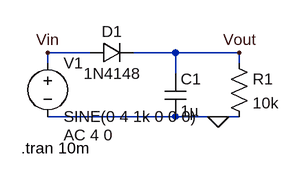
[diagram p0: schematic 9c.asc]
9c.asc, the LTspice schematic file:
Version 4
SHEET 1 880 680
WIRE 160 96 96 96
WIRE 288 96 224 96
WIRE 384 96 288 96
WIRE 96 112 96 96
WIRE 384 112 384 96
WIRE 288 128 288 96
WIRE 288 192 96 192
WIRE 352 192 288 192
WIRE 384 192 352 192
FLAG 352 192 0
FLAG 96 96 Vin
FLAG 384 96 Vout
SYMBOL voltage 96 96 R0
WINDOW 123 24 124 Left 2
WINDOW 39 0 0 Left 0
SYMATTR Value2 AC 4 0
SYMATTR InstName V1
SYMATTR Value SINE(0 4 1k 0 0 0)
SYMBOL res 368 96 R0
SYMATTR InstName R1
SYMATTR Value 10k
SYMBOL cap 272 128 R0
SYMATTR InstName C1
SYMATTR Value 1µ
SYMBOL diode 160 112 R270
WINDOW 0 32 32 VTop 2
WINDOW 3 0 32 VBottom 2
SYMATTR InstName D1
SYMATTR Value 1N4148
TEXT 56 240 Left 2 !.tran 10m

The netlist it stands for:
* 9c.asc
V1 Vin 0 SINE(0 4 1k 0 0 0) AC 4 0
R1 Vout 0 10k
C1 Vout 0 1µ
D1 Vin Vout 1N4148
.model D D
.lib standard.dio
.tran 10m
.backanno
.end